# Altium schematic sheet Naive.SchDoc
size A; SheetNumber: 1; SheetTotal: 7
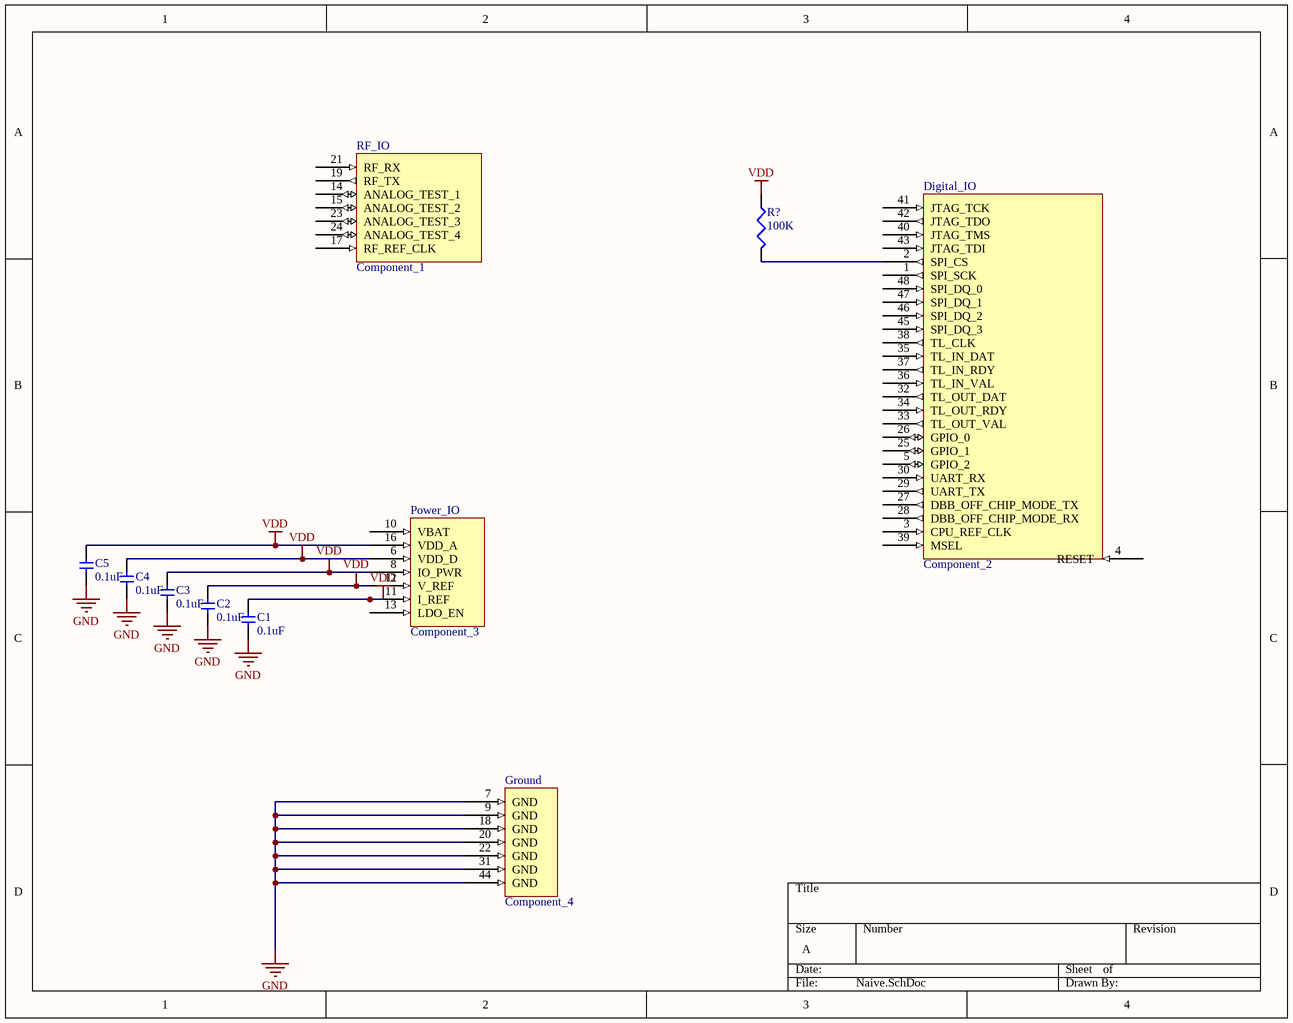
[diagram p0: Naive.SchDoc]

## Parts
C1  0.1uF  [0402]
C2  0.1uF  [0402]
C3  0.1uF  [0402]
C4  0.1uF  [0402]
C5  0.1uF  [0402]
Digital_IO  Component_2
Ground  Component_4
Power_IO  Component_3
R?  100K  [0402]
RF_IO  Component_1

## Nets
GND: C1.2 C2.2 C3.2 C4.2 C5.2 Ground.7(GND) Ground.9(GND) Ground.18(GND) Ground.20(GND) Ground.22(GND) Ground.31(GND) Ground.44(GND)
VDD: C1.1 C2.1 C3.1 C4.1 C5.1 Power_IO.6(VDD_D) Power_IO.8(IO_PWR) Power_IO.11(I_REF) Power_IO.12(V_REF) Power_IO.16(VDD_A) R?.1
NetDigital_IO_2: Digital_IO.2(SPI_CS) R?.2

Not connected (* = marked no-connect by the designer): Digital_IO 1(SPI_SCK) 3(CPU_REF_CLK) 4(RESET) 5(GPIO_2) 25(GPIO_1) 26(GPIO_0) 27(DBB_OFF_CHIP_MODE_TX) 28(DBB_OFF_CHIP_MODE_RX) 29(UART_TX) 30(UART_RX) 32(TL_OUT_DAT) 33(TL_OUT_VAL) 34(TL_OUT_RDY) 35(TL_IN_DAT) 36(TL_IN_VAL) 37(TL_IN_RDY) 38(TL_CLK) 39(MSEL) 40(JTAG_TMS) 41(JTAG_TCK) 42(JTAG_TDO) 43(JTAG_TDI) 45(SPI_DQ_3) 46(SPI_DQ_2) 47(SPI_DQ_1) 48(SPI_DQ_0); Power_IO 10(VBAT) 13(LDO_EN); RF_IO 14(ANALOG_TEST_1) 15(ANALOG_TEST_2) 17(RF_REF_CLK) 19(RF_TX) 21(RF_RX) 23(ANALOG_TEST_3) 24(ANALOG_TEST_4)

## Library data of the parts
C1-C5 = DISCRETE_C: 0.1uF 0402
R? = DISCRETE_R